# EAGLE design SHT21-Breakout-v2b (EAGLE 5.10)
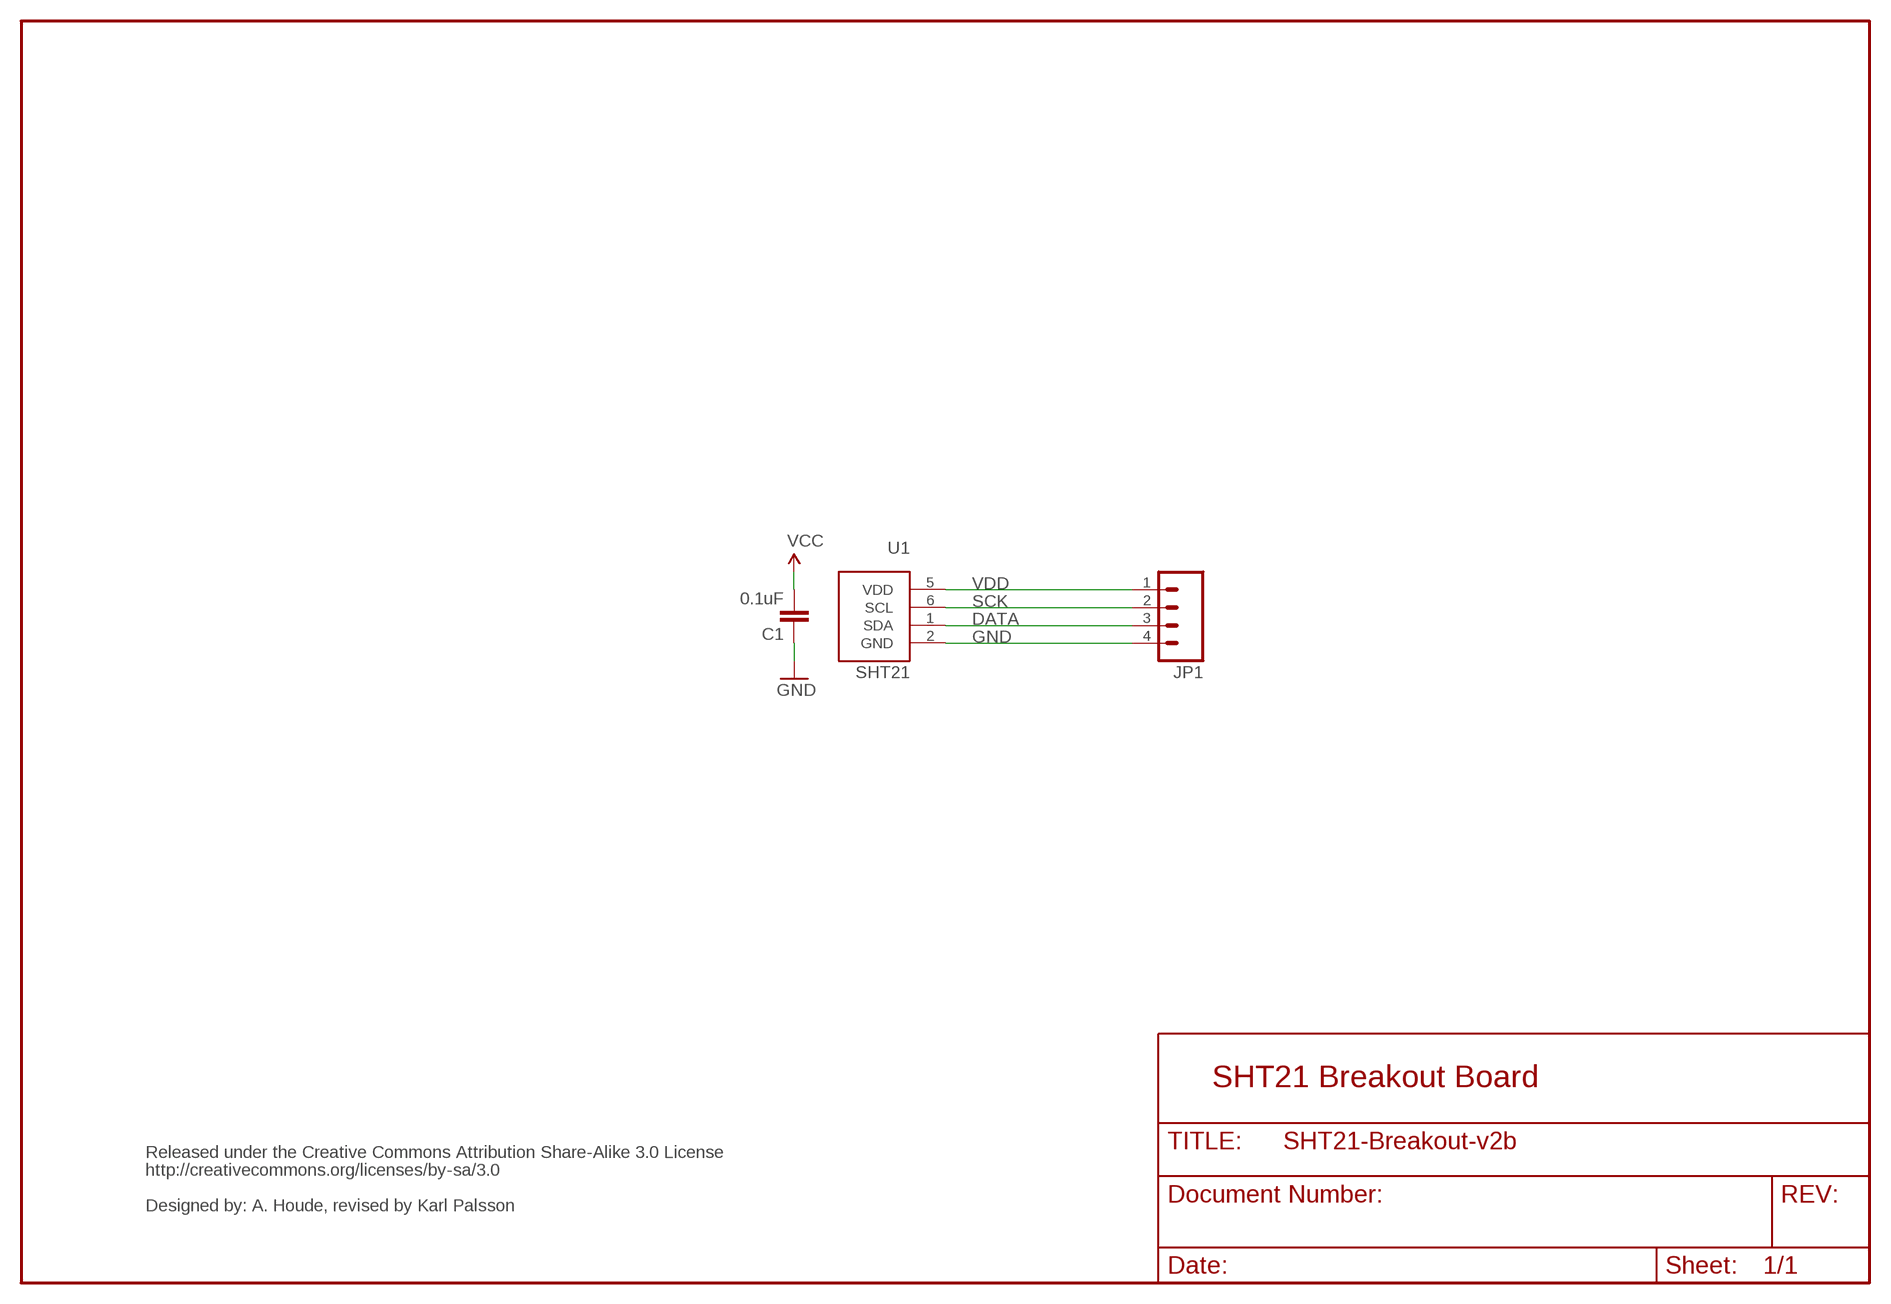
[diagram p0: schematic, sheet 1]

## Parts
C1  0.1uF  CAP0603-CAP  [0603-CAP]
JP1  M04PTH  [1X04]
U1  SHT21  [SHT21]

## Nets
DATA: JP1.3 U1.1(SDA)
GND [power]: C1.1 JP1.4 U1.2(GND)
SCK: JP1.2 U1.6(SCL)
VDD: C1.2 JP1.1 U1.5(VDD) ; supply symbol labelled VCC

## Notes on the sheet
- SHT21 Breakout Board
- Released under the Creative Commons Attribution Share-Alike 3.0 License
- http://creativecommons.org/licenses/by-sa/3.0
- Designed by: A. Houde, revised by Karl Palsson

## Library data of the parts
C1 = SparkFun:CAP: Capacitor Standard 0603 ceramic capacitor, and 0.1" leaded capacitor.
JP1 = SparkFun:M04: Header 4 Standard 4-pin 0.1" header. Use with straight break away headers (SKU : PRT-00116), right angle break away headers (PRT-00553), swiss pins (PRT-00743), machine pins (PRT-00117), and female headers (PRT-00115). Molex polarized connector foot print use with SKU : PRT-08231 with associated crimp pins and housings.
U1 = ALX:SHT21

## Net classes
0 default: width 0.203 mm
1 power: width 0.305 mm

## Board
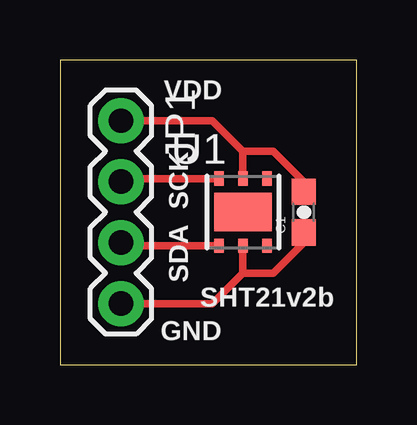
[diagram p1: board, top side]

Size 12.37 x 12.69 mm. Coordinates in mm from the lower left corner, seen from the top.
Outline: 0,0 12.37,0 12.37,12.69 0,12.69 0,0
Copper layers (1*16): Top 0.035mm / dielectric 1.5mm / Bottom 0.035mm
Design rules "olimex-10mils": minimum track width 10mil, minimum drill 24mil, track to track 10mil, track to pad 10mil, pad to pad 10mil, via to via 10mil, smd to smd 10mil, copper to edge 40mil, drill to drill 10mil, minimum pad ring 10mil, minimum via ring 8mil, stop-mask expansion 0mil, vias tented up to drill 0mil, thermal gap 10mil

### Footprints (pad centres in the part's own frame; a part is rotated, then mirrored left to right if it is on the bottom)
0603-CAP = smd 1.1 x 1: 1 -0.85,0; 2 0.85,0
1X04 = drill 1.016 pad 1.88 round: 1 0,0; 2 2.54,0; 3 5.08,0; 4 7.62,0
SHT21 = smd 0.4 x 0.6: 1 -1,-1.4; 2 0,-1.4; 3 1,-1.4; 4 1,1.4; 5 0,1.4; 6 -1,1.4 | smd 2.4 x 1.6: P$7 0,0

### Placement (x,y rotation side)
C1  10.16,6.35 90 top
JP1  2.54,10.16 270 top
U1  7.62,6.35 0 top

### Tracks (layer width: path | path; a pad name or v marks a point on that pad's centre or on a via)
DATA
  Top 0.305: U1.1 2.67,4.95 JP1.3
GND
  Top 0.305: 7.62,3.81 U1.2 | 7.62,3.81 6.35,2.54 JP1.4 | C1.1 10.16,5.08 8.89,3.81 7.62,3.81
SCK
  Top 0.305: U1.6 2.67,7.75 JP1.2
VDD
  Top 0.254: 10.16,7.62 C1.2
  Top 0.305: 7.62,8.89 U1.5 | 7.62,8.89 6.35,10.16 JP1.1 | 10.16,7.62 8.89,8.89 7.62,8.89

### Text on the board
tPlace: VDD | SCK | SDA | SHT21v2b | GND